# EAGLE design hw-proto03 (EAGLE 7.3.0)
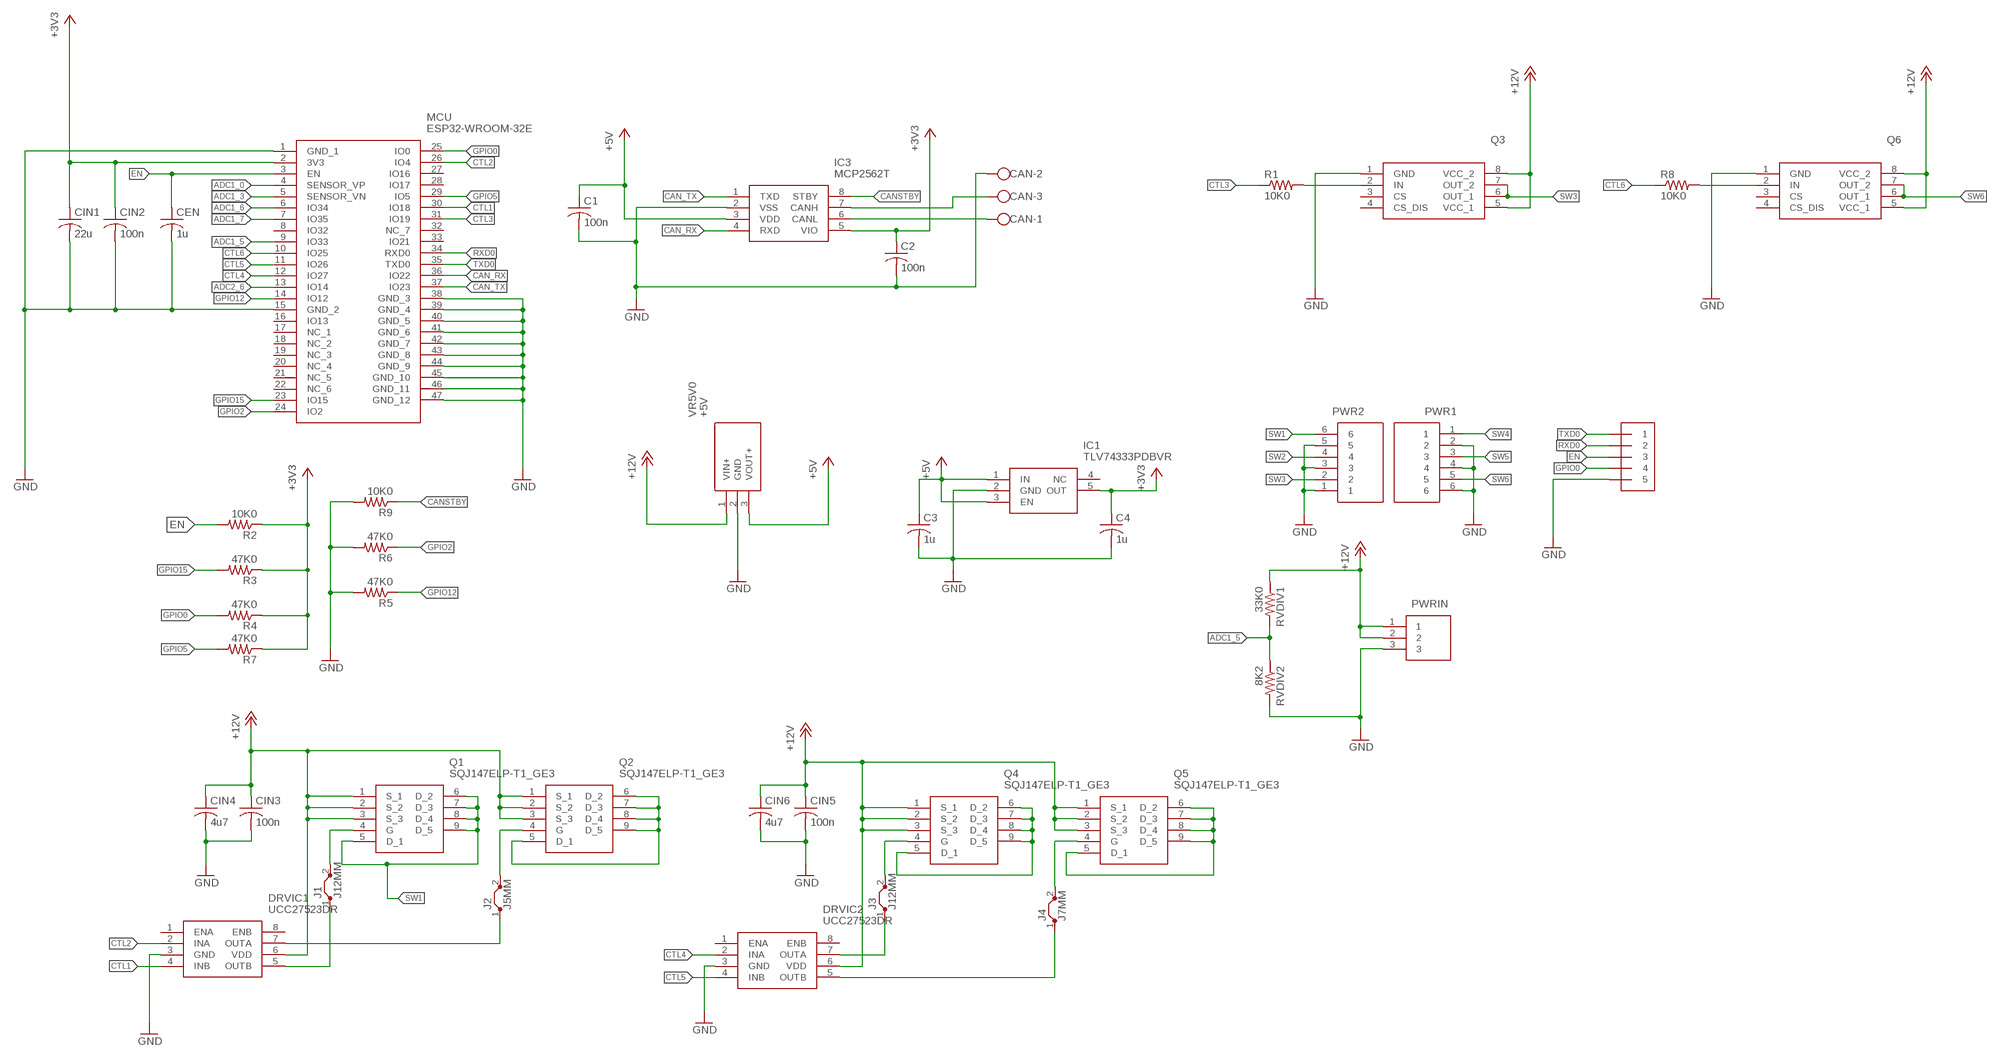
[diagram p0: schematic, sheet 1]

## Parts
C1  100n  C-USC0603K  [C0603K]
C2  100n  C-USC0603K  [C0603K]
C3  1u  C-USC0603K  [C0603K]
C4  1u  C-USC0603K  [C0603K]
CAN  W237-103  [W237-103]
CEN  1u  C-USC0603K  [C0603K]
CIN1  22u  C-USC0805K  [C0805K]
CIN2  100n  C-USC0603K  [C0603K]
CIN3  100n  C-USC0603K  [C0603K]
CIN4  4u7  C-USC0805K  [C0805K]
CIN5  100n  C-USC0603K  [C0603K]
CIN6  4u7  C-USC0805K  [C0805K]
DRVIC1  UCC27523DR  [SOIC127P600X175-8N]
DRVIC2  UCC27523DR  [SOIC127P600X175-8N]
IC1  TLV74333PDBVR  [SOT95P280X145-5N]
IC3  MCP2562T  MCP2562T-H_SN  [SOIC127P600X175-8N]
J1  J12MM  [12]
J2  J5MM  [05]
J3  J12MM  [12]
J4  J7MM  [07]
MCU  ESP32-WROOM-32E  ESP32-WROOM-32E-N8R2  [ESP32WROOM32EN8R2]
PROG  1X5  [1X05-3.5MM]
PWR1  4DB-P108-06  [4DBP10806]
PWR2  4DB-P108-06  [4DBP10806]
PWRIN  4DB-P108-03  [4DBP10803]
Q1  SQJ147ELP-T1_GE3  [SQJ147ELPT1_GE3]
Q2  SQJ147ELP-T1_GE3  [SQJ147ELPT1_GE3]
Q3  VN5E160MSTR-E  [SOIC127P600X175-8N]
Q4  SQJ147ELP-T1_GE3  [SQJ147ELPT1_GE3]
Q5  SQJ147ELP-T1_GE3  [SQJ147ELPT1_GE3]
Q6  VN5E160MSTR-E  [SOIC127P600X175-8N]
R1  10K0  R-US_0204/7  [0204/7]
R2  10K0  R-US_R0603  [R0603]
R3  47K0  R-US_R0603  [R0603]
R4  47K0  R-US_R0603  [R0603]
R5  47K0  R-US_R0603  [R0603]
R6  47K0  R-US_R0603  [R0603]
R7  47K0  R-US_R0603  [R0603]
R8  10K0  R-US_0207/12  [0207/12]
R9  10K0  R-US_R0603  [R0603]
RVDIV1  33K0  R-US_R0603  [R0603]
RVDIV2  8K2  R-US_R0603  [R0603]
VR5V0  +5V  TSR_1-2433E  [TSR-1-2433]

## Nets
+3V3: C2.1 C4.1 CIN1.1 CIN2.1 IC1.5(OUT) IC3.5(VIO) MCU.2(3V3) R2.1 R3.1 R4.1 R7.1
+5V: C1.1 C3.1 IC1.1(IN) IC1.3(EN) IC3.3(VDD) VR5V0.3(VOUT+)
+12V: CIN3.1 CIN4.1 CIN5.1 CIN6.1 DRVIC1.6(VDD) DRVIC2.6(VDD) PWRIN.1 PWRIN.2 Q1.1(S_1) Q1.2(S_2) Q1.3(S_3) Q2.1(S_1) Q2.2(S_2) Q2.3(S_3) Q3.5(VCC_1) Q3.8(VCC_2) Q4.1(S_1) Q4.2(S_2) Q4.3(S_3) Q5.1(S_1) Q5.2(S_2) Q5.3(S_3) Q6.5(VCC_1) Q6.8(VCC_2) RVDIV1.1 VR5V0.1(VIN+)
ADC1_0: MCU.4(SENSOR_VP)
ADC1_3: MCU.5(SENSOR_VN)
ADC1_5: MCU.9(IO33) RVDIV1.2 RVDIV2.1
ADC1_6: MCU.6(IO34)
ADC1_7: MCU.7(IO35)
ADC2_6: MCU.13(IO14)
CAN_RX: IC3.4(RXD) MCU.36(IO22)
CAN_TX: IC3.1(TXD) MCU.37(IO23)
CANSTBY: IC3.8(STBY) R9.1
CTL1: DRVIC1.4(INB) MCU.30(IO18)
CTL2: DRVIC1.2(INA) MCU.26(IO4)
CTL3: MCU.31(IO19) R1.1
CTL4: DRVIC2.2(INA) MCU.12(IO27)
CTL5: DRVIC2.4(INB) MCU.11(IO26)
CTL6: MCU.10(IO25) R8.1
EN: CEN.1 MCU.3(EN) PROG.3 R2.2
GND: C1.2 C2.2 C3.2 C4.2 CAN.2 CEN.2 CIN1.2 CIN2.2 CIN3.2 CIN4.2 CIN5.2 CIN6.2 DRVIC1.3(GND) DRVIC2.3(GND) IC1.2(GND) IC3.2(VSS) MCU.1(GND_1) MCU.15(GND_2) MCU.38(GND_3) MCU.39(GND_4) MCU.40(GND_5) MCU.41(GND_6) MCU.42(GND_7) MCU.43(GND_8) MCU.44(GND_9) MCU.45(GND_10) MCU.46(GND_11) MCU.47(GND_12) PROG.5 PWR1.2 PWR1.4 PWR1.6 PWR2.1 PWR2.3 PWR2.5 PWRIN.3 Q3.1(GND) Q6.1(GND) R5.2 R6.2 R9.2 RVDIV2.2 VR5V0.2(GND)
GPIO0: MCU.25(IO0) PROG.4 R4.2
GPIO2: MCU.24(IO2) R6.1
GPIO5: MCU.29(IO5) R7.2
GPIO12: MCU.14(IO12) R5.1
GPIO15: MCU.23(IO15) R3.2
N$1: CAN.3 IC3.7(CANH)
N$2: CAN.1 IC3.6(CANL)
N$4: DRVIC1.5(OUTB) J1.1
N$5: J1.2 Q1.4(G)
N$6: J2.2 Q2.4(G)
N$7: Q3.2(IN) R1.2
N$8: DRVIC2.5(OUTB) J4.1
N$9: DRVIC2.7(OUTA) J3.1
N$10: J3.2 Q4.4(G)
N$11: J4.2 Q5.4(G)
N$12: Q6.2(IN) R8.2
N$13: DRVIC1.7(OUTA) J2.1
RXD0: MCU.34(RXD0) PROG.2
SW1: PWR2.6 Q1.5(D_1) Q1.6(D_2) Q1.7(D_3) Q1.8(D_4) Q1.9(D_5)
SW2: PWR2.4 Q2.5(D_1) Q2.6(D_2) Q2.7(D_3) Q2.8(D_4) Q2.9(D_5)
SW3: PWR2.2 Q3.6(OUT_1) Q3.7(OUT_2)
SW4: PWR1.1 Q4.5(D_1) Q4.6(D_2) Q4.7(D_3) Q4.8(D_4) Q4.9(D_5)
SW5: PWR1.3 Q5.5(D_1) Q5.6(D_2) Q5.7(D_3) Q5.8(D_4) Q5.9(D_5)
SW6: PWR1.5 Q6.6(OUT_1) Q6.7(OUT_2)
TXD0: MCU.35(TXD0) PROG.1
Unconnected: DRVIC1.1(ENA) DRVIC1.8(ENB) DRVIC2.1(ENA) DRVIC2.8(ENB) IC1.4(NC) MCU.8(IO32) MCU.16(IO13) MCU.17(NC_1) MCU.18(NC_2) MCU.19(NC_3) MCU.20(NC_4) MCU.21(NC_5) MCU.22(NC_6) MCU.27(IO16) MCU.28(IO17) MCU.32(NC_7) MCU.33(IO21) Q3.3(CS) Q3.4(CS_DIS) Q6.3(CS) Q6.4(CS_DIS)

## Library data of the parts
C1-C4 CEN CIN1-CIN6 = rcl:C-US: CAPACITOR, American symbol
CAN = con-wago-500:W237-103: WAGO SCREW CLAMP; MPN: 237-103; OC_FARNELL: unknown; OC_NEWARK: 18M7116
DRVIC1 DRVIC2 = UCC27523DR-fet-driver:UCC27523DR: Dual, 5A, High-Speed Low-Side Power MOSFET Driver Source: Datasheet <http://www.ti.com/lit/gpn/ucc27523>; DESCRIPTION: Dual, 5A, High-Speed Low-Side Power MOSFET Driver; HEIGHT: 1.75mm; MANUFACTURER_NAME: Texas Instruments; MANUFACTURER_PART_NUMBER: UCC27523DR; MOUSER_PART_NUMBER: 595-UCC27523DR; MOUSER_PRICE-STOCK: https://www.mouser.co.uk/ProductDetail/Texas-Instruments/UCC27523DR/?qs=JK0Mn6q9DKQ5jNt3UHw5hw%3D%3D
IC1 = TLV74333PDBVR:TLV74333PDBVR: 300mA Low-Dropout (LDO) Regulator Source: Datasheet <http://www.ti.com/lit/gpn/tlv743p>; DESCRIPTION: 300mA Low-Dropout (LDO) Regulator; HEIGHT: 1.45mm; MANUFACTURER_NAME: Texas Instruments; MANUFACTURER_PART_NUMBER: TLV74333PDBVR; MOUSER_PART_NUMBER: 595-TLV74333PDBVR; MOUSER_PRICE-STOCK: https://www.mouser.co.uk/ProductDetail/Texas-Instruments/TLV74333PDBVR?qs=EU6FO9ffTwe08kePOwcQGA%3D%3D
IC3 = MCP2562T-H_SN:MCP2562T-H_SN: CAN Interface IC Source: Datasheet <https://componentsearchengine.com/Datasheets/1/MCP2562T-H_SN.pdf>; DESCRIPTION: CAN Interface IC; HEIGHT: 1.75mm; MANUFACTURER_NAME: Microchip; MANUFACTURER_PART_NUMBER: MCP2562T-H/SN; MOUSER_PART_NUMBER: 579-MCP2562T-H/SN; MOUSER_PRICE-STOCK: https://www.mouser.co.uk/ProductDetail/Microchip-Technology/MCP2562T-H-SN?qs=eTPcRhULBzwloCb8Xxk0jQ%3D%3D
J1-J4 = jumper:J: Bridge
MCU = ESP32-WROOM-32E-N8R2:ESP32-WROOM-32E-N8R2: Multiprotocol Modules ESP32-WROOM-32E integrates ESP32-D0WD-V3, with higher stability and safety performance. Source: Datasheet <https://www.espressif.com/sites/default/files/documentation/esp32-wroom-32e_esp32-wroom-32ue_datasheet_en.pdf>; DESCRIPTION: Multiprotocol Modules ESP32-WROOM-32E integrates ESP32-D0WD-V3, with higher stability and safety performance.; HEIGHT: 3.25mm; MANUFACTURER_NAME: Espressif Systems; MANUFACTURER_PART_NUMBER: ESP32-WROOM-32E-N8R2; MOUSER_PART_NUMBER: 356-ESP32WRM32EN8R2; MOUSER_PRICE-STOCK: https://www.mouser.co.uk/ProductDetail/Espressif-Systems/ESP32-WROOM-32E-N8R2?qs=By6Nw2ByBD0mvGJSS3Ohlw%3D%3D
PROG = adafruit:1X5
PWR1 PWR2 = 4DB-P108-06:4DB-P108-06: Dual Barrier, Printed Circuit Pin, Wire-to-Board, 6 Position, 8.26 mm [.325 in] Centerline, 1 Row, Buchanan 4DB Series, Barrier Strips Source: Datasheet <https://www.te.com/commerce/DocumentDelivery/DDEController?Action=srchrtrv&DocNm=1-1773458-2_BARRIER_STRIPS_QRG&DocType=Data Sheet&DocLang=English&PartCntxt=2-1437667-9&DocFormat=pdf>; DESCRIPTION: Dual Barrier, Printed Circuit Pin, Wire-to-Board, 6 Position, 8.26 mm [.325 in] Centerline, 1 Row, Buchanan 4DB Series, Barrier Strips; HEIGHT: 13.716mm; MANUFACTURER_NAME: TE Connectivity; MANUFACTURER_PART_NUMBER: 4DB-P108-06; MOUSER_PART_NUMBER: N/A; MOUSER_PRICE-STOCK: https://www.mouser.co.uk/ProductDetail/TE-Connectivity/4DB-P108-06?qs=JZD3Rbs9Xzm1xbyNfnCHaQ%3D%3D
PWRIN = con-barrier-3pos:4DB-P108-03: Dual Barrier, Printed Circuit Pin, Wire-to-Board, 3 Position, 8.26 mm [.325 in] Centerline, 1 Row, Buchanan 4DB Series, Barrier Strips Source: Datasheet <https://www.mouser.co.il/datasheet/2/418/9/ENG_CD_2_1437667_4_N9-624224.pdfhttps://www.te.com/commerce/DocumentDelivery/DDEController?Action=srchrtrv&DocNm=1-1773458-2_BARRIER_STRIPS_QRG&DocType=Data Sheet&DocLang=English&PartCntxt=2-1437667-5&DocFormat>; DESCRIPTION: Dual Barrier, Printed Circuit Pin, Wire-to-Board, 3 Position, 8.26 mm [.325 in] Centerline, 1 Row, Buchanan 4DB Series, Barrier Strips; HEIGHT: 13.589mm; MANUFACTURER_NAME: TE Connectivity; MANUFACTURER_PART_NUMBER: 4DB-P108-03; MOUSER_PART_NUMBER: 571-214376675; MOUSER_PRICE-STOCK: https://www.mouser.co.uk/ProductDetail/TE-Connectivity/4DB-P108-03?qs=cX92MwKKzGt2YIn2dZcfJQ%3D%3D
Q1 Q2 Q4 Q5 = transistor-vishay-pchan-pso8:SQJ147ELP-T1_GE3: MOSFET P-CHANNEL 40-V (D-S) 175C MOSFET Source: Datasheet <https://www.vishay.com/docs/77857/sqj147elp.pdf>; DESCRIPTION: MOSFET P-CHANNEL 40-V (D-S) 175C MOSFET; HEIGHT: 1.227mm; MANUFACTURER_NAME: Vishay; MANUFACTURER_PART_NUMBER: SQJ147ELP-T1_GE3; MOUSER_PART_NUMBER: 78-SQJ147ELP-T1_GE3; MOUSER_PRICE-STOCK: https://www.mouser.co.uk/ProductDetail/Vishay-Siliconix/SQJ147ELP-T1_GE3?qs=81r%252BiQLm7BRdyhBg3DuaKw%3D%3D
Q3 Q6 = VN5E160MSTR-E:VN5E160MSTR-E: Gate Drivers SNGL CH HI-SIDE DRVR W/ANALOG CRRNT SNSE Source: Datasheet <https://componentsearchengine.com/Datasheets/2/VN5E160MSTR-E.pdf>; DESCRIPTION: Gate Drivers SNGL CH HI-SIDE DRVR W/ANALOG CRRNT SNSE; HEIGHT: 1.75mm; MANUFACTURER_NAME: STMicroelectronics; MANUFACTURER_PART_NUMBER: VN5E160MSTR-E; MOUSER_PART_NUMBER: 511-VN5E160MSTR-E; MOUSER_PRICE-STOCK: https://www.mouser.co.uk/ProductDetail/STMicroelectronics/VN5E160MSTR-E?qs=WSSg0AwdCh77XxtxsYEeyw%3D%3D
R1-R9 RVDIV1 RVDIV2 = rcl:R-US_: RESISTOR, American symbol
VR5V0 = TSR_1-2433E:TSR_1-2433E: 1 Amp POL converter, industrial, 6-36 VDC input, pos.-pos. circuit, cost efficient, LM78 compatible, SIP-3 Source: Datasheet <https://tracopower.com/tsr1e-datasheet/>; DESCRIPTION: 1 Amp POL converter, industrial, 6-36 VDC input, pos.-pos. circuit, cost efficient, LM78 compatible, SIP-3; HEIGHT: mm; MANUFACTURER_NAME: Traco Power; MANUFACTURER_PART_NUMBER: TSR 1-2433E; MOUSER_PART_NUMBER: 495-TSR1-2433E; MOUSER_PRICE-STOCK: https://www.mouser.co.uk/ProductDetail/TRACO-Power/TSR-1-2433E?qs=vmHwEFxEFR9haWIzn8wG3A%3D%3D

## Board
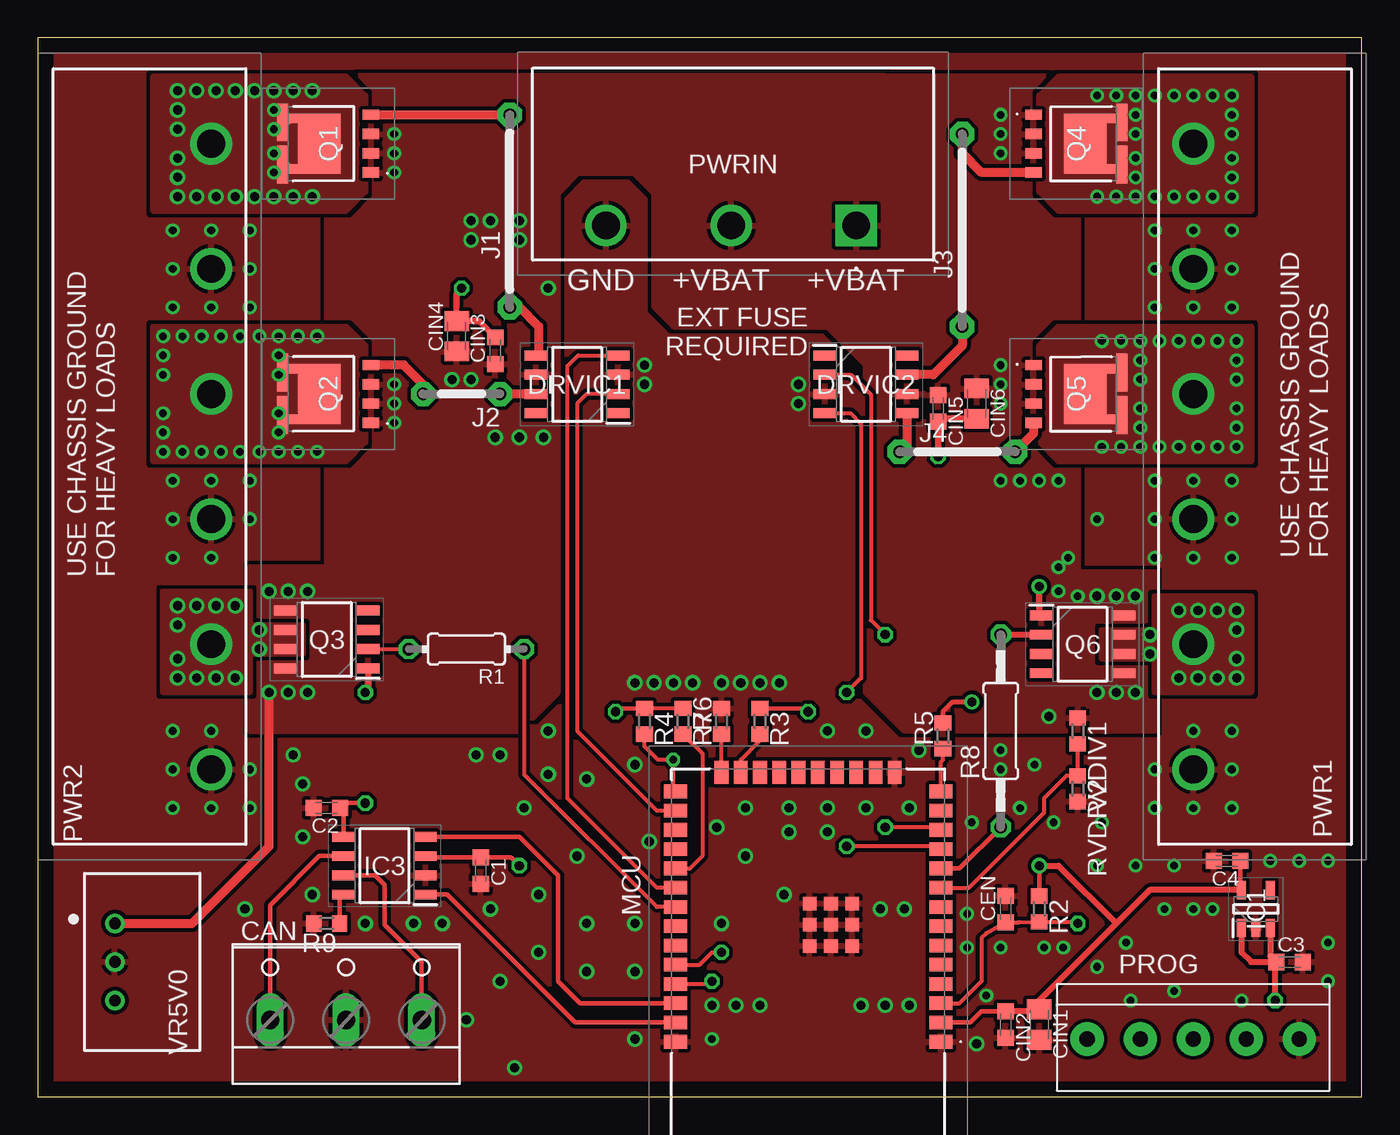
[diagram p1: board, top side]
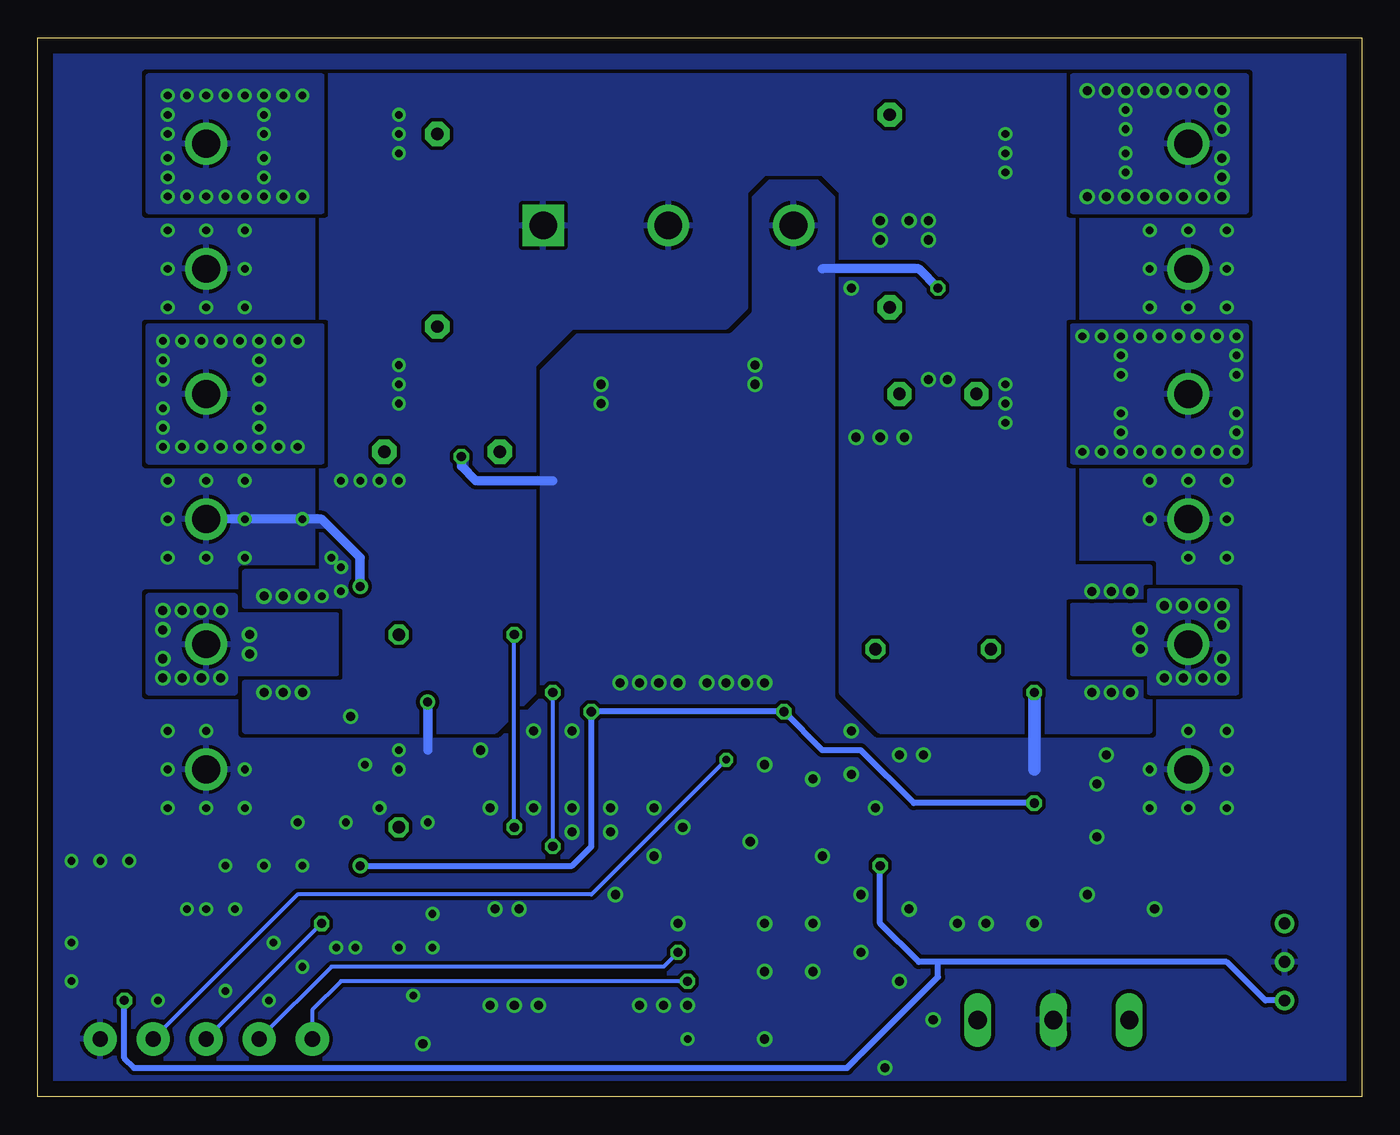
[diagram p2: board, bottom side, seen from below]

Size 87.3 x 69.84 mm. Coordinates in mm from the lower left corner, seen from the top.
Outline: 0,0 87.3,0 87.3,69.84 0,69.84 0,0
Copper layers (1*16): Top 0.035mm / dielectric 1.5mm / Bottom 0.035mm
Design rules "default": minimum track width 10mil, minimum drill 24mil, track to track 8mil, track to pad 8mil, pad to pad 8mil, via to via 8mil, smd to smd 8mil, copper to edge 40mil, drill to drill 8mil, minimum pad ring 10mil, minimum via ring 8mil, stop-mask expansion 4mil, vias tented up to drill 0mil, thermal gap 10mil

### Footprints (pad centres in the part's own frame; a part is rotated, then mirrored left to right if it is on the bottom)
C0603K = smd 1.05 x 1.08: 1 -0.875,0; 2 0.875,0
W237-103 = drill 1.194 long: 1 -5,-1.29; 2 0,-1.29; 3 5,-1.29
C0805K = smd 1.3 x 1.6: 1 -1,0; 2 1,0
SOIC127P600X175-8N = smd 1.525 x 0.65: 1 -2.712,1.905; 2 -2.712,0.635; 3 -2.712,-0.635; 4 -2.712,-1.905; 5 2.712,-1.905; 6 2.712,-0.635; 7 2.712,0.635; 8 2.712,1.905
SOT95P280X145-5N = smd 1.2 x 0.6: 1 -1.25,0.95; 2 -1.25,0; 3 -1.25,-0.95; 4 1.25,-0.95; 5 1.25,0.95
SOIC127P600X175-8N' = smd 1.5 x 0.65: 1 -2.7,1.905; 2 -2.7,0.635; 3 -2.7,-0.635; 4 -2.7,-1.905; 5 2.7,-1.905; 6 2.7,-0.635; 7 2.7,0.635; 8 2.7,1.905
12 = drill 0.813 pad 1.6 octagon: 1 -6.35,0; 2 6.35,0
05 = drill 0.813 pad 1.6 octagon: 1 -2.54,0; 2 2.54,0
07 = drill 0.813 pad 1.6 octagon: 1 -3.81,0; 2 3.81,0
ESP32WROOM32EN8R2 = smd 1.5 x 0.9: 1 -8.75,5.26; 2 -8.75,3.99; 3 -8.75,2.72; 4 -8.75,1.45; 5 -8.75,0.18; 6 -8.75,-1.09; 7 -8.75,-2.36; 8 -8.75,-3.63; 9 -8.75,-4.9; 10 -8.75,-6.17; 11 -8.75,-7.44; 12 -8.75,-8.71; 13 -8.75,-9.98; 14 -8.75,-11.25; 25 8.75,-11.25; 26 8.75,-9.98; 27 8.75,-8.71; 28 8.75,-7.44; 29 8.75,-6.17; 30 8.75,-4.9; 31 8.75,-3.63; 32 8.75,-2.36; 33 8.75,-1.09; 34 8.75,0.18; 35 8.75,1.45; 36 8.75,2.72; 37 8.75,3.99; 38 8.75,5.26 | smd 0.9 x 1.5: 15 -5.715,-12.5; 16 -4.445,-12.5; 17 -3.175,-12.5; 18 -1.905,-12.5; 19 -0.635,-12.5; 20 0.635,-12.5; 21 1.905,-12.5; 22 3.175,-12.5; 23 4.445,-12.5; 24 5.715,-12.5 | smd 0.9 x 0.9: 39 -1.5,-2.46; 40 -2.9,-2.46; 41 -2.9,-3.86; 42 -1.5,-3.86; 43 -0.1,-3.86; 44 -0.1,-2.46; 45 -0.1,-1.06; 46 -1.5,-1.06; 47 -2.9,-1.06
1X05-3.5MM = drill 1 pad 2.184: 1 7,0; 2 3.5,0; 3 0,0; 4 -3.5,0; 5 -7,0
4DBP10806 = drill 1.829 pad 2.743: 1 0,0; 2 8.255,0; 3 16.51,0; 4 24.765,0; 5 33.02,0; 6 41.275,0
4DBP10803 = drill 1.829 pad 2.743 square: 1 0,0 | drill 1.829 pad 2.743: 2 8.255,0; 3 16.51,0
SQJ147ELPT1_GE3 = smd 0.68 x 1.1: 1 -1.905,-2.913; 2 -0.635,-2.913; 3 0.635,-2.913; 4 1.905,-2.913 | smd 2.5 x 0.71: 5 1.4,2.913; 6 -1.4,2.913 | smd 0.63 x 0.66: 7 1.665,2.228; 8 -1.665,2.228 | smd 3.96 x 2.82: 9 0,0.487
0204/7 = drill 0.813 octagon: 1 -3.81,0; 2 3.81,0
R0603 = smd 1 x 1.1: 1 -0.85,0; 2 0.85,0
0207/12 = drill 0.813 octagon: 1 -6.35,0; 2 6.35,0
TSR-1-2433 = drill 0.78 pad 1.28: 1 -2.54,0; 2 0,0; 3 2.54,0

### Placement (x,y rotation side)
C1  29.21,14.92 270 top
C2  19.05,19.05 180 top
C3  82.55,8.89 0 top
C4  78.42,15.56 180 top
CAN  20.32,6.35 0 top
CEN  63.82,12.38 90 top
CIN1  66.04,4.76 270 top
CIN2  63.82,4.76 270 top
CIN3  30.16,49.21 90 top
CIN4  27.62,50.16 90 top
CIN5  59.37,45.4 270 top
CIN6  61.91,45.72 270 top
DRVIC1  35.56,46.99 180 top
DRVIC2  54.61,46.99 0 top
IC1  80.33,12.38 90 top
IC3  MCP2562T  [SOIC127P600X175-8N']  22.86,15.24 180 top
J1  31.11,58.42 90 top
J2  27.94,46.35 180 top
J3  60.96,57.15 90 top
J4  60.64,42.54 0 top
MCU  50.8,8.89 180 top
PROG  76.2,3.81 180 top
PWR1  76.2,62.87 270 top
PWR2  11.43,21.59 90 top
PWRIN  53.97,57.47 180 top
Q1  19.05,62.87 90 top
Q2  19.05,46.35 90 top
Q3  19.05,30.16 180 top
Q4  68.58,62.87 270 top
Q5  68.58,46.35 270 top
Q6  68.9,29.84 0 top
R1  28.26,29.53 180 top
R2  66.04,12.38 270 top
R3  47.62,24.77 270 top
R4  40,24.77 270 top
R5  59.69,23.81 90 top
R6  45.08,24.77 90 top
R7  42.54,24.77 270 top
R8  63.5,24.13 90 top
R9  19.05,11.43 180 top
RVDIV1  68.58,24.13 270 top
RVDIV2  68.58,20.32 270 top
VR5V0  5.08,8.89 270 top

### Tracks (layer width: path | path; a pad name or v marks a point on that pad's centre or on a via)
+3V3  (via drill 0.6)
  Top 0.254: R7.1 R4.1
  Top 0.305: IC3.5 20.16,18.82 C2.1 20.24,19.37 v21.59,19.37 | IC1.5 79.3,13.63 C4.1 | MCU.2 61.49,4.9 62.23,5.64 CIN2.1 | R2.1 v66.04,15.24 | R3.1 50.58,25.62 v50.8,25.4 | R4.1 38.31,25.62 v38.1,25.4
  Top 0.406: 79.3,13.63 73.32,13.63 71.12,11.43 | 71.12,11.43 66.04,6.35 CIN1.1 65.92,5.64 CIN2.1 | v66.04,15.24 67.31,15.24 71.12,11.43
  Bottom 0.406: v66.04,15.24 52.07,15.24 50.8,16.51 v50.8,25.4 v38.1,25.4 35.56,22.86 33.02,22.86 29.53,19.37 v21.59,19.37
+5V  (via drill 0.6)
  Top 0.305: IC3.3 25.56,15.8 C1.1 31.19,15.8 v31.75,15.24
  Top 0.406: IC1.3 81.28,9.29 C3.1 | IC1.1 79.38,9.52 80.01,8.89 C3.1 | v81.6,6.35 81.6,8.81 C3.1
  Bottom 0.406: VR5V0.3 6.35,6.35 8.89,8.89 27.94,8.89 | 27.94,8.89 29.21,8.89 31.75,11.43 v31.75,15.24 | 27.94,8.89 27.94,7.9 33.93,1.9 80.96,1.9 81.6,2.54 v81.6,6.35
+12V  (via drill 0.5, 0.6)
  Top 0.61: VR5V0.1 10.16,11.43 15.24,16.51 v15.24,26.67
  other vias: 69.85,33.02 71.12,33.02 72.39,33.02 69.85,26.67 71.12,26.67 72.39,26.67 17.78,33.34 16.51,33.34 15.24,33.34 16.51,26.67 17.78,26.67 23.5,63.5 23.5,62.23 23.5,60.96 23.5,46.99 23.5,45.72 23.5,44.45 63.5,64.77 63.5,63.5 63.5,62.23 63.5,48.26 63.5,46.99 63.5,45.72 66.67,25.08 63.5,40.64 64.77,40.64 66.04,40.64 67.31,40.64 67.95,35.56 68.58,33.02 67.31,34.92 67.31,33.34 29.84,57.78 28.57,57.78 28.57,56.51 31.75,56.51 31.75,57.78 33.65,53.34 28.57,47.31 27.3,47.31 33.34,43.5 31.75,43.5 30.16,43.5
  pour Top (isolate 0.254, rank 4): 41.91,67.31 68.58,67.31 68.58,34.61 73.66,34.61 73.66,24.13 57.15,24.13 54.61,26.67 54.61,48.26 52.07,50.8 41.91,50.8
  pour Top (isolate 0.254, rank 4): 55.88,67.31 19.05,67.31 19.05,34.92 13.97,34.92 13.97,24.13 31.75,24.13 34.29,26.67 34.29,59.61 35.64,60.96 39.29,60.96 40.64,59.61 40.64,52.11 41.95,50.8 55.88,50.8
  pour Bottom (isolate 0.254, rank 4): 13.97,24.13 13.97,27.94 19.05,27.94 19.05,32.38 13.97,32.38 13.97,34.92 19.05,34.92 19.05,67.31 68.58,67.31 68.58,34.61 73.66,34.61 73.66,32.38 67.31,32.38 67.31,27.3 73.66,27.3 73.66,24.13 57.15,24.13 54.61,26.67 54.61,48.26 52.07,50.8 41.91,50.8 40.64,52.07 40.64,59.69 39.37,60.96 35.56,60.96 34.29,59.69 34.29,26.67 31.75,24.13
  pour Top (isolate 0.254, rank 4, no thermals): 13.97,34.29 19.05,34.29 19.05,31.11 13.97,31.11
  pour Top (isolate 0.254, rank 4, no thermals): 14.29,29.21 19.05,29.21 19.05,25.72 14.29,25.72
  pour Top (isolate 0.254, rank 5, no thermals): 69.22,33.65 73.34,33.65 73.34,31.11 69.22,31.11
  pour Top (isolate 0.254, rank 5, no thermals): 69.22,28.57 73.66,28.57 73.66,25.72 69.22,25.72
ADC1_5
  Top 0.254: MCU.9 61.41,13.79 66.36,18.73 66.36,19.68 67.84,21.17 RVDIV2.1 RVDIV1.2
CAN_RX
  Top 0.305: IC3.4 31.75,17.14 34.29,14.61 34.29,7.62 35.74,6.17 MCU.36
CAN_TX
  Top 0.305: IC3.1 26.99,13.34 35.42,4.9 MCU.37
CANSTBY
  Top 0.305: IC3.8 19.9,13.34 R9.1
CTL1
  Top 0.254: MCU.30 40.82,13.79 34.92,19.68 34.92,48.18 35.63,48.89 DRVIC1.4
CTL2
  Top 0.254: MCU.26 40.82,18.87 35.56,24.13 35.56,45.72 36.2,46.35 DRVIC1.2
CTL3
  Top 0.254: MCU.31 40.82,12.52 32.07,21.27 R1.1
CTL4  (via drill 0.6)
  Top 0.254: v55.88,30.48 54.93,31.43 54.93,46.32 53.62,47.62 DRVIC2.2 | MCU.12 59.37,17.78 v55.88,17.78
  Bottom 0.254: v55.88,17.78 v55.88,30.48
CTL5  (via drill 0.6)
  Top 0.254: v53.34,26.67 54.29,27.62 54.29,44.38 53.58,45.08 DRVIC2.4 | MCU.11 59.37,16.51 v53.34,16.51
  Bottom 0.254: v53.34,16.51 v53.34,26.67
CTL6
  Top 0.305: MCU.10 60.78,15.06 R8.1
EN  (via drill 0.6)
  Top 0.254: MCU.3 60.78,6.17 62.23,7.62 62.23,10.48 62.55,10.79 CEN.1 64.75,11.51 R2.2 68.37,11.53 v68.58,11.43
  Bottom 0.254: PROG.3 v68.58,11.43
GND  (via drill 0.5, 0.6)
  Top 0.305: v61.59,26.04 60.32,26.04 59.69,25.4 R5.2
  Top 0.406: Q3.1 21.76,26.84 v21.59,26.67 | Q6.1 66.04,31.9 v66.04,33.65 | CIN6.2 59.56,44.72 CIN5.2 v59.37,42.23 | v27.94,53.34 27.62,53.02 CIN4.2 29.09,51.16 CIN3.2
  Bottom 0.61: v66.04,33.65 66.04,35.56 68.58,38.1 PWR1.4 | v61.59,26.04 61.59,22.86 | v59.37,42.23 59.37,41.59 58.42,40.64 53.34,40.64 | v27.94,53.34 29.21,54.61 35.56,54.61
  Bottom 0.813: v21.59,26.67 21.59,21.59
  other vias: 39.37,11.43 39.37,21.91 39.37,3.81 61.91,3.49 39.37,27.3 45.08,27.3 39.37,8.26 66.36,9.84 67.63,9.84 36.2,20.96 40.32,16.83 33.65,21.27 33.65,24.13 29.84,12.38 33.02,9.53 33.02,13.34 54.61,24.13 63.5,9.84 62.55,6.67 52.07,19.05 52.07,17.46 54.61,19.05 57.47,19.05 52.07,24.13 40.64,27.3 41.91,27.3 43.18,27.3 46.35,27.3 47.62,27.3 48.89,27.3 58.1,22.86 49.53,19.05 49.53,17.46 46.67,19.05 46.67,15.88 44.77,17.78 49.21,13.34 55.56,12.38 57.15,12.38 45.08,11.43 44.45,6.03 57.47,6.03 55.88,6.03 46.04,6.03 47.62,6.03 54.29,6.03 30.48,7.62 31.43,1.9 28.26,5.08 36.2,8.26 36.2,11.43 35.56,15.88 32.07,19.05 30.48,22.54 28.89,22.54 18.1,13.34 21.59,11.43 24.77,11.43 26.67,11.43 17.46,17.14 17.46,20.64 16.83,22.54 13.65,12.38 63.5,22.86 63.5,21.59 61.59,18.1 69.85,15.24 72.39,15.24 74.93,15.24 81.28,15.56 83.19,15.56 85.09,15.56 85.09,10.16 85.09,7.62 77.47,12.38 76.2,12.38 74.3,12.38 74.93,6.99 71.76,10.16 69.85,8.57 72.07,6.35 79.38,6.35 44.45,3.81 8.89,57.15 11.43,57.15 13.97,57.15 8.89,52.07 11.43,52.07 13.97,52.07 13.97,54.61 8.89,54.61 8.89,40.64 8.89,38.1 8.89,35.56 11.43,35.56 13.97,38.1 13.97,40.64 11.43,40.64 8.89,21.59 8.89,24.13 11.43,24.13 13.97,21.59 13.97,19.05 11.43,19.05 8.89,19.05 76.2,24.13 78.74,24.13 78.74,21.59 78.74,19.05 76.2,19.05 73.66,19.05 73.66,21.59 76.2,35.56 78.74,35.56 78.74,38.1 78.74,40.64 76.2,40.64 73.66,40.64 73.66,38.1 73.66,54.61 73.66,57.15 76.2,57.15 78.74,57.15 78.74,54.61 78.74,52.07 76.2,52.07 73.66,52.07 69.85,38.1 65.72,21.91 66.99,18.1 70.17,18.1 61.28,12.07 61.28,9.84 73.66,35.56 64.77,19.05 50.16,46.99 50.16,45.72 40,48.26 40,46.99
  pour Bottom (isolate 0.254, rank 6): 0,69.85 87.63,69.85 87.63,0 0,0
  pour Top (isolate 0.254, rank 6): 0,69.85 87.63,69.85 87.63,0 0,0
GPIO0  (via drill 0.5)
  Top 0.254: MCU.25 42.05,20.32 41.91,20.32 v41.91,22.23 40.9,22.23 40,23.12 R4.2
  Bottom 0.254: PROG.4 70.17,13.34 50.8,13.34 v41.91,22.23
GPIO2
  Top 0.254: MCU.24 R6.1
GPIO5
  Top 0.254: R7.2 43.81,22.64 43.81,15.88 43,15.06 MCU.29
GPIO12
  Top 0.254: MCU.14 59.55,22.09 59.69,22.23 R5.1
GPIO15
  Top 0.254: MCU.23 46.35,22.23 47.62,23.5 R3.2
N$1
  Top 0.305: CAN.3 25.32,8.89 22.86,11.35 22.86,13.97 22.23,14.61 IC3.7
N$2
  Top 0.305: IC3.6 18.56,15.88 15.32,12.64 CAN.1
N$4
  Top 0.61: J1.1 31.75,52.07 33.02,50.8 33.02,49.07 DRVIC1.5
N$5
  Top 0.61: Q1.4 J1.2
N$6
  Top 0.61: J2.2 25.4,46.99 24.13,48.26 Q2.4
N$7
  Top 0.254: Q3.2 R1.2
N$8
  Top 0.61: 56.96,42.67 J4.1 57.32,43.03 DRVIC2.5
N$9
  Top 0.61: J3.1 60.96,49.53 59.05,47.62 DRVIC2.7
N$10
  Top 0.61: Q4.4 62.23,60.96 60.96,62.23 J3.2
N$11
  Top 0.61: Q5.4 65.67,43.76 J4.2
N$12
  Top 0.406: R8.2 Q6.2
N$13
  Top 0.61: DRVIC1.7 J2.1
RXD0  (via drill 0.6)
  Top 0.254: MCU.34 43.63,8.71 44.45,9.53 v45.08,9.53
  Bottom 0.254: v45.08,9.53 46.04,8.57 67.94,8.57 PROG.2
SW1  (via drill 0.5, 0.6)
  Top 0.254: Q1.8 16.56,61.46 Q1.6 | Q1.7 16.56,64.27 Q1.5
  other vias: 15.56,66.36 16.83,66.36 18.1,66.36 18.1,59.37 16.83,59.37 15.56,59.37 14.29,66.36 14.29,59.37 13.02,66.36 11.75,66.36 10.48,66.36 9.21,66.36 9.21,65.09 9.21,60.64 9.21,59.37 10.48,59.37 11.75,59.37 13.02,59.37 9.21,63.82 9.21,61.91 15.56,65.09 15.56,63.82 15.56,62.23 15.56,60.96
  pour Top (isolate 0.254, rank 3, no thermals): 7.62,67.31 20.32,67.31 21.59,66.04 21.59,59.69 20.32,58.42 7.62,58.42
  pour Bottom (isolate 0.254, rank 3): 7.62,67.31 19.05,67.31 19.05,58.42 7.62,58.42
SW2  (via drill 0.5)
  other vias: 8.26,50.16 9.53,50.16 10.79,50.16 12.07,50.16 13.34,50.16 14.61,50.16 15.88,50.16 17.14,50.16 18.41,50.16 18.41,42.54 17.14,42.54 15.88,42.54 14.61,42.54 13.34,42.54 12.07,42.54 10.79,42.54 9.53,42.54 8.26,42.54 8.26,43.81 8.26,45.08 8.26,48.89 8.26,47.62 15.88,48.89 15.88,47.62 15.88,43.81 15.88,45.08
  pour Top (isolate 0.254, rank 3, no thermals): 7.62,50.8 20.32,50.8 21.59,49.53 21.59,43.18 20.32,41.91 7.62,41.91
  pour Bottom (isolate 0.254, rank 3): 7.62,50.8 19.05,50.8 19.05,41.91 7.62,41.91
SW3  (via drill 0.6)
  other vias: 14.61,30.8 14.61,29.53 13.02,32.38 11.75,32.38 10.48,32.38 9.21,32.38 9.21,32.38 13.02,27.62 13.02,27.62 11.75,27.62 10.48,27.62 9.21,27.62 9.21,28.89 9.21,31.11
  pour Top (isolate 0.254, rank 3, no thermals): 8.26,33.34 13.97,33.34 13.97,31.11 17.46,31.11 17.46,29.21 13.97,29.21 13.97,26.67 8.26,26.67
  pour Bottom (isolate 0.254, rank 3): 8.26,33.34 13.97,33.34 13.97,32.38 19.05,32.38 19.05,27.94 13.97,27.94 13.97,26.67 8.26,26.67
SW4  (via drill 0.5)
  other vias: 78.74,66.04 77.47,66.04 76.2,66.04 74.93,66.04 73.66,66.04 72.39,66.04 71.12,66.04 69.85,66.04 69.85,59.37 71.12,59.37 72.39,59.37 73.66,59.37 74.93,59.37 76.2,59.37 77.47,59.37 78.74,59.37 78.74,60.64 78.74,61.91 78.74,64.77 78.74,63.5 72.39,64.77 72.39,63.5 72.39,60.64 72.39,61.91
  pour Top (isolate 0.254, rank 3, no thermals): 80.01,58.42 67.31,58.42 66.04,59.69 66.04,66.04 67.31,67.31 80.01,67.31
  pour Bottom (isolate 0.254, rank 3): 68.58,67.31 80.01,67.31 80.01,58.42 68.58,58.42
SW5  (via drill 0.5)
  other vias: 79.06,49.85 77.79,49.85 76.52,49.85 75.25,49.85 73.98,49.85 72.71,49.85 71.44,49.85 70.17,49.85 70.17,42.86 71.44,42.86 72.71,42.86 73.98,42.86 75.25,42.86 76.52,42.86 77.79,42.86 79.06,42.86 79.06,44.13 79.06,45.4 79.06,48.58 79.06,47.31 72.71,48.58 72.71,47.31 72.71,44.13 72.71,45.4
  pour Top (isolate 0.254, rank 3, no thermals): 80.01,41.91 67.31,41.91 66.04,43.18 66.04,49.53 67.31,50.8 80.01,50.8
  pour Bottom (isolate 0.254, rank 3): 68.58,50.8 80.01,50.8 80.01,41.91 68.58,41.91
SW6  (via drill 0.6)
  other vias: 73.34,30.48 73.34,29.21 75.25,32.07 76.52,32.07 77.79,32.07 79.06,32.07 75.25,27.62 76.52,27.62 77.79,27.62 79.06,27.62 79.06,28.89 79.06,30.8
  pour Top (isolate 0.254, rank 3, no thermals): 70.17,30.8 73.66,30.8 73.66,33.02 80.01,33.02 80.01,26.67 73.66,26.67 73.66,28.89 70.17,28.89
  pour Bottom (isolate 0.254, rank 3): 67.63,31.75 74.3,31.75 74.3,33.02 80.01,33.02 80.01,26.67 74.3,26.67 74.3,27.94 67.63,27.94
TXD0  (via drill 0.6)
  Top 0.254: MCU.35 44.27,7.44 v44.45,7.62
  Bottom 0.254: v44.45,7.62 67.31,7.62 69.2,5.73 PROG.1

### Text on the board
tNames: GND | +VBAT | +VBAT | EXT FUSE / REQUIRED | USE CHASSIS GROUND / FOR HEAVY LOADS | USE CHASSIS GROUND / FOR HEAVY LOADS